# EAGLE design midimixer-st-eval (EAGLE 7.2.0)
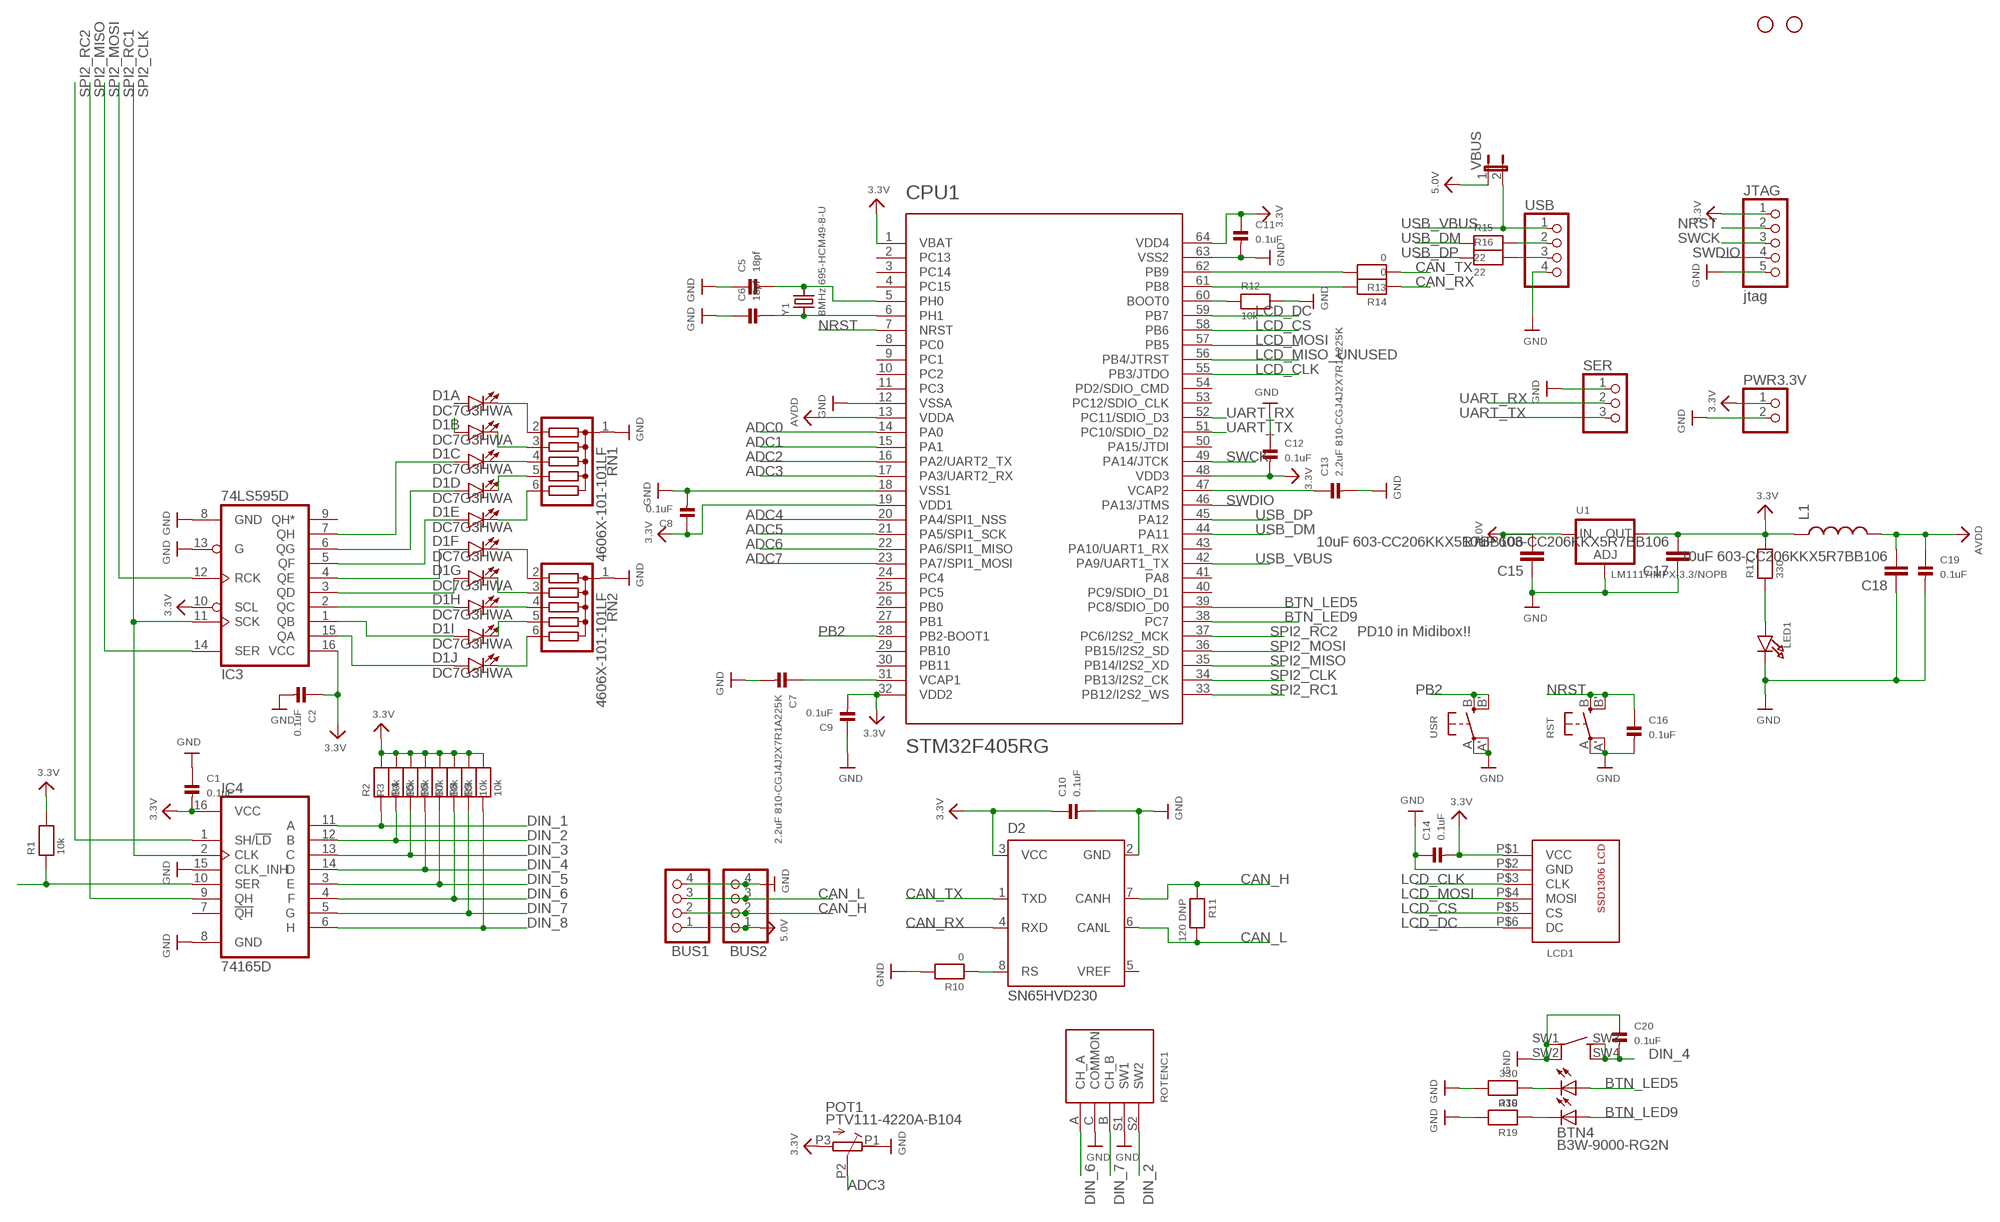
[diagram p0: schematic, sheet 1]

## Parts
BTN4  B3W-9000-RG2N  [B3W-9000-X2X]
BUS1  HEADER-1X4ROUND  [1X04_ROUND]
BUS2  HEADER-1X4ROUND  [1X04_ROUND]
C1  0.1uF  CAP_CERAMIC0603  [0603]
C2  0.1uF  CAP_CERAMIC0603  [0603]
C5  18pf  CAP_CERAMIC0603  [0603]
C6  18pf  CAP_CERAMIC0603  [0603]
C7  2.2uF 810-CGJ4J2X7R1A225K  CAP_CERAMIC0805  [0805]
C8  0.1uF  CAP_CERAMIC0603  [0603]
C9  0.1uF  CAP_CERAMIC0603  [0603]
C10  0.1uF  CAP_CERAMIC0603  [0603]
C11  0.1uF  CAP_CERAMIC0603  [0603]
C12  0.1uF  CAP_CERAMIC0603  [0603]
C13  2.2uF 810-CGJ4J2X7R1A225K  CAP_CERAMIC0805  [0805]
C14  0.1uF  CAP_CERAMIC0603  [0603]
C15  10uF 603-CC206KKX5R7BB106  CAP1206  [1206]
C16  0.1uF  CAP_CERAMIC0603  [0603]
C17  10uF 603-CC206KKX5R7BB106  CAP1206  [1206]
C18  10uF 603-CC206KKX5R7BB106  CAP1206  [1206]
C19  0.1uF  CAP_CERAMIC0603  [0603]
C20  0.1uF  CAP_CERAMIC0603  [0603]
CPU1  STM32F405RG  [TQFP64]
D1  DC7G3HWA  LED_BARGRAPH_10  [LED_BARGAPH_10]
D2  SN65HVD230  [SO8]
H1  STAND-OFF  [STAND-OFF]
H3  STAND-OFF  [STAND-OFF]
IC3  74LS595D  [SO16]
IC4  74165D  [SO16]
JTAG  jtag  HEADER-1X576MIL  [1X05_ROUND_76]
L1  INDUCTOR0805  [0805]
LCD1  SSD1306-ALI  [SSD1306-ALI]
LED1  LED0603  [CHIPLED_0603]
POT1  PTV111-4220A-B104  [PTV111-4]
PWR3.3V  HEADER-1X2ROUND  [1X02_ROUND]
R1  10k  RESISTOR_0603  [_0603]
R2  10k  RESISTOR_0603  [_0603]
R3  10k  RESISTOR_0603  [_0603]
R4  10k  RESISTOR_0603  [_0603]
R5  10k  RESISTOR_0603  [_0603]
R6  10k  RESISTOR_0603  [_0603]
R7  10k  RESISTOR_0603  [_0603]
R8  10k  RESISTOR_0603  [_0603]
R9  10k  RESISTOR_0603  [_0603]
R10  0  RESISTOR_0603  [_0603]
R11  120 DNP  RESISTOR_0603  [_0603]
R12  10k  RESISTOR_0603  [_0603]
R13  0  RESISTOR_0603  [_0603]
R14  0  RESISTOR_0603  [_0603]
R15  22  RESISTOR0603  [0603]
R16  22  RESISTOR0603  [0603]
R17  330  RESISTOR0603  [0603]
R18  330  RESISTOR0603  [0603]
R19  330  RESISTOR0603  [0603]
RN1  4606X-101-101LF  G05R  [SIL6]
RN2  4606X-101-101LF  G05R  [SIL6]
ROTENC1  PEC11-4215K-S0024  [PEC111-4XXXK-SXXXX]
RST  SWITCH_TACT_SMT  [EVQ-Q2]
SER  HEADER-1X3ROUND  [1X03_ROUND]
U1  LM1117IMPX-3.3/NOPB  LM1117SOT223-REFLOW  [SOT223-R]
USB  HEADER-1X4ROUND  [1X04_ROUND]
USR  SWITCH_TACT_SMT  [EVQ-Q2]
VBUS  JUMPER2  [JUMPER2]
Y1  8MHz 695-HCM49-8-U  CRYSTALSMD  [HC49UP]

## Nets
3.3V: C1.2 C2.1 C8.1 C9.2 C10.1 C11.1 C12.2 C14.2 C17.2 CPU1.1(VBAT) CPU1.19(VDD1) CPU1.32(VDD2) CPU1.48(VDD3) CPU1.64(VDD4) D2.3(VCC) IC3.10(SCL) IC3.16(VCC) IC4.16(VCC) JTAG.1 L1.1 LCD1.P$1(VCC) POT1.P3(E) PWR3.3V.1 R1.2 R2.2 R3.2 R4.2 R5.2 R6.2 R7.2 R8.2 R9.2 R17.2 U1.2(OUT)
5.0V: BUS1.1 BUS2.1 C15.2 U1.3(IN) VBUS.1
ADC0: CPU1.14(PA0)
ADC1: CPU1.15(PA1)
ADC2: CPU1.16(PA2/UART2_TX)
ADC3: CPU1.17(PA3/UART2_RX) POT1.P2(S)
ADC4: CPU1.20(PA4/SPI1_NSS)
ADC5: CPU1.21(PA5/SPI1_SCK)
ADC6: CPU1.22(PA6/SPI1_MISO)
ADC7: CPU1.23(PA7/SPI1_MOSI)
AVDD: C18.2 C19.1 CPU1.13(VDDA) L1.2
BTN_LED5: BTN4.LED1+ CPU1.39(PC8/SDIO_D0)
BTN_LED9: BTN4.LED2+ CPU1.38(PC7)
CAN_H: BUS1.2 BUS2.2 D2.7(CANH) R11.1
CAN_L: BUS1.3 BUS2.3 D2.6(CANL) R11.2
CAN_RX: D2.4(RXD) R14.1
CAN_TX: D2.1(TXD) R13.1
DIN_1: IC4.11(A) R2.1
DIN_2: IC4.12(B) R3.1 ROTENC1.S2(SW2)
DIN_3: IC4.13(C) R4.1
DIN_4: BTN4.SW3(SW2_A) BTN4.SW4(SW2_B) C20.2 IC4.14(D) R5.1
DIN_5: IC4.3(E) R6.1
DIN_6: IC4.4(F) R7.1 ROTENC1.A(CH_A)
DIN_7: IC4.5(G) R8.1 ROTENC1.B(CH_B)
DIN_8: IC4.6(H) R9.1
GND: BTN4.SW1(SW1_A) BTN4.SW2(SW1_B) BUS1.4 BUS2.4 C1.1 C2.2 C5.1 C6.1 C7.2 C8.2 C9.1 C10.2 C11.2 C12.1 C13.2 C14.1 C15.1 C16.2 C17.1 C18.1 C19.2 C20.1 CPU1.12(VSSA) CPU1.18(VSS1) CPU1.63(VSS2) D2.2(GND) IC3.8(GND) IC3.13(G) IC4.8(GND) IC4.15(CLK_INH) JTAG.5 LCD1.P$2(GND) LED1.C POT1.P1(A) PWR3.3V.2 R10.2 R12.2 R18.2 R19.2 RN1.1 RN2.1 ROTENC1.C(COMMON) ROTENC1.S1(SW1) RST.A'(P1) RST.A(P) SER.1 U1.1(ADJ) USB.4 USR.A'(P1) USR.A(P)
LCD_CLK: CPU1.55(PB3/JTDO) LCD1.P$3(CLK)
LCD_CS: CPU1.58(PB6) LCD1.P$5(CS)
LCD_DC: CPU1.59(PB7) LCD1.P$6(DC)
LCD_MISO_UNUSED: CPU1.56(PB4/JTRST)
LCD_MOSI: CPU1.57(PB5) LCD1.P$4(MOSI)
N$1: C6.2 CPU1.6(PH1) Y1.1
N$2: C5.2 CPU1.5(PH0) Y1.2
N$3: C13.1 CPU1.47(VCAP2)
N$4: C7.1 CPU1.31(VCAP1)
N$5: LED1.A R17.1
N$6: CPU1.60(BOOT0) R12.1
N$7: R15.2 USB.2
N$8: R16.2 USB.3
N$9: BTN4.LED1- R18.1
N$10: BTN4.LED2- R19.1
N$11: D1.2(B:A)
N$13: CPU1.62(PB9) R13.2
N$14: D1.20(A:C) RN1.2
N$15: D1.19(B:C) RN1.3
N$16: D1.18(C:C) RN1.4
N$17: D1.17(D:C) RN1.5
N$18: D1.16(E:C) RN1.6
N$19: D1.15(F:C) RN2.2
N$20: D1.14(G:C) RN2.3
N$21: D1.13(H:C) RN2.4
N$22: D1.12(I:C) RN2.5
N$23: D1.11(J:C) RN2.6
N$27: CPU1.61(PB8) R14.2
N$28: IC4.10(SER) R1.1
N$49: D1.10(J:A) IC3.15(QA)
N$50: D1.9(I:A) IC3.1(QB)
N$51: D1.8(H:A) IC3.2(QC)
N$52: D1.7(G:A) IC3.3(QD)
N$53: D1.6(F:A) IC3.4(QE)
N$54: D1.5(E:A) IC3.5(QF)
N$55: D1.4(D:A) IC3.6(QG)
N$56: D1.3(C:A) IC3.7(QH)
N$73: D2.8(RS) R10.1
NRST: C16.1 CPU1.7(NRST) JTAG.2 RST.B'(S1) RST.B(S)
PB2: CPU1.28(PB2-BOOT1) USR.B'(S1) USR.B(S)
SPI2_CLK: CPU1.34(PB13/I2S2_CK) IC3.11(SCK) IC4.2(CLK)
SPI2_MISO: CPU1.35(PB14/I2S2_XD) IC4.9(QH)
SPI2_MOSI: CPU1.36(PB15/I2S2_SD) IC3.14(SER)
SPI2_RC1: CPU1.33(PB12/I2S2_WS) IC3.12(RCK)
SPI2_RC2: CPU1.37(PC6/I2S2_MCK) IC4.1(SH/!LD)
SWCK: CPU1.49(PA14/JTCK) JTAG.3
SWDIO: CPU1.46(PA13/JTMS) JTAG.4
UART_RX: CPU1.52(PC11/SDIO_D3) SER.2
UART_TX: CPU1.51(PC10/SDIO_D2) SER.3
USB_DM: CPU1.44(PA11) R15.1
USB_DP: CPU1.45(PA12) R16.1
USB_VBUS: CPU1.42(PA9/UART1_TX) USB.1 VBUS.2
Unconnected: CPU1.2(PC13) CPU1.3(PC14) CPU1.4(PC15) CPU1.8(PC0) CPU1.9(PC1) CPU1.10(PC2) CPU1.11(PC3) CPU1.24(PC4) CPU1.25(PC5) CPU1.26(PB0) CPU1.27(PB1) CPU1.29(PB10) CPU1.30(PB11) CPU1.40(PC9/SDIO_D1) CPU1.41(PA8) CPU1.43(PA10/UART1_RX) CPU1.50(PA15/JTDI) CPU1.53(PC12/SDIO_CLK) CPU1.54(PD2/SDIO_CMD) D1.1(A:A) D2.5(VREF) IC3.9(QH*) IC4.7(!QH)

## Notes on the sheet
- PD10 in Midibox!!

## Library data of the parts
BTN4 = keves:B3W-9000-RG2N
BUS1 BUS2 USB = microbuilder:HEADER-1X4: PIN HEADER
C1 C2 C5-C14 C16 C19 C20 = microbuilder:CAP_CERAMIC: Ceramic Capacitors 0402 - 0402 Surface Mount Capacitors 16pF 50V 5% [Digikey: 445-4899-2-ND] 18pF 50V 5% [Digikey: 490-1281-2-ND] 22pF 50V 5% [Digikey: 490-1283-2-ND] 68pF 50V 5% [Digikey: 490-1289-2-ND] 0.1uF 10V 10% [Digikey: 490-1318-2-ND] 1.0uF 6.3V 10% [Digikey: 490-1320-2-ND] 0603 - 0603 Surface Mount Capacitors 16 pF 50V 5% [Digikey: 445-5051-2-ND] 22 pF 50V [Digikey: PCC220ACVTR-ND] 33 pF 50V 5% [Digikey: 490-1415-1-ND] 56pF 50V 5% [Digikey: 490-1421-1-ND] 220pF 50V 5% [Digikey: 445-1285-1-ND] 680 pF 50V 2200 pF 50V 5% C0G [Digikey: 445-1297-1-ND] 5600 pF 100V 5% X7R [Digikey: 478-3711-1-ND] 0.1 µF 25V 10% [Digikey: PCC2277TR-ND] 0.22 µF 16V 10% X7R [Digikey: 445-1318-1-ND] 1.0 µF 25V 10% [Digikey: 445-5146-2-ND] 0603 - RF Specific 3pF 250V +/-0.1pF RF [Digikey: 712-1347-1-ND] 18 pF 250V 5% [Digikey: 478-3505-1-ND or 712-1322-1-ND] 56 pF 250V 5% C0G RF [Digikey: 490-4867-1-ND] 68 pF 250V RF [Digikey: 490-4868-1-ND] 0805 - 0805 Surface Mount Capacitors 220 pF 250V 2% RF Ceramic Capacitor [Digikey: 712-1398-1-ND] 1000 pF 50V 2% NP0 Ceramic Capacitor [Digikey: 478-3760-1-ND] 0.1 µF 25V 10% Ceramic Capacitor [Digikey: PCC1828TR-ND] 1.0 µF 16V 10% Ceramic Capacitor[Digikey: 490-1691-2-ND] 10.0 µF 10V 10% Ceramic Capacitor[Digikey: 709-1228-1-ND] 10.0 uF 16V 10% Ceramic Capacitor [Digikey: 478-5165-2-ND] 47 uF 6.3V 20% Ceramic Capacitor [Digikey: 587-1779-1-ND or 399-5506-1-ND] 1206 - 1206 Surface Mount Capacitors 47uF 10V 20% Ceramic Capacitor [Digikey: 490-5528-1-ND or 399-5508-1-ND or 445-6010-1-ND] 100uF 6.3V -20%, +80% Y5V Ceramic Capacitor (Digikey: 490-4512-1-ND, Mouser: 81-GRM31CF50J107ZE1L)
C15 C17 C18 = SparkFun-Passives:CAP: Capacitor Standard 0603 ceramic capacitor, and 0.1" leaded capacitor.
CPU1 = SparkFun-DigitalIC:STM32F405RG: ARM DSP Chip used on the WAV Trigger board.
D1 = SparkFun-LED:LED_BARGRAPH_10: 10-Segment LED Bar Graph SFE part numbers: COM-09935 (red, Vf = 2.1V, Ifmax = 20mA) COM-09936 (yellow, Vf = 2.1V, Ifmax = 20mA) COM-09937 (blue, Vf = 3.4V, Ifmax = 20mA) COM-09938 (green, Vf = 3.4V, Ifmax = 20mA)
D2 = omc:SN65HVD230: SN65HVD230 - 3.3V CAN Transceiver - 3.3V operation - ISO 11898 compliant - up to 1Mbps - up to 120 nodes - listen only mode - slope control
H1 H3 = SparkFun-Electromechanical:STAND-OFF: #4 Stand Off This is the mechanical footprint for a #4 phillips button head screw. Use the keepout ring to avoid running the screw head into surrounding components. SKU : PRT-00447
IC3 = SparkFun-DigitalIC:74*595: 8-bit SHIFT REGISTER, output latch; PROD_ID: IC-07875
IC4 = SparkFun-DigitalIC:74*165
JTAG = microbuilder:HEADER-1X5: PIN HEADER
L1 = SparkFun-Passives:INDUCTOR: Inductors Basic Inductor/Choke - 0603 and 1206. Footprints are not proven and vary greatly between part numbers. INDUCTOR POWER 3.3UH 4.0A SMD 0.197" L x 0.197" W x 0.177" H (5.00mm x 5.00mm x 4.50mm)
LCD1 = keves:SSD1306-ALI
LED1 = microbuilder:LED: LED 0603 - 0603 Surface Mount Package 2mA: Green LED - Low Power (3.9mcd, 2ma, 1.7Vf) - Digikey: 475-2709-2-ND Orange LED - Low Power (9.8mcd, 2ma, 1.8Vf) - Digikey: 475-1194-2-ND Red LED - Low Power (5mcd, 2ma, 1.8Vf) - Digikey: 475-1195-2-ND Yellow LED - Low Power (7mcd, 2ma, 1.8Vf) - Digikey: 475-1196-2-ND 5mA: Blue LED - Low Power (17mcd, 5ma, 2.9Vf) - Digikey: LNJ937W8CRACT-ND 0805 - 0805 Surface Mount Package 2mA: Red LED (8.8mcd, 2mA, 1.8Vf, Clear) - Low Power [Digikey: 475-2510-1-ND] Green LED (5mcd, 2mA, 1.8Vf, Clear) - Low Power [Digikey: 475-2730-1-ND] Yellow LED (11.3mcd, 2mA, 1.8Vf, Clear) - Low Power [Digikey: 475-2555-1-ND] 20mA: Red LED (104mcd, 20mA, Diffused) - LS R976 [Digikey: 475-1278-6-ND] Red LED (12mcd, 20mA, 2.0Vf, Clear) - APT2012EC [Digikey: 754-1128-1-ND] Green LED (15mcd, 20mA, 2.2Vf, Clear) - APT2012GC [Digikey: 754-1131-1-ND] Orange LED (160mcd, 20mA, 2.1Vf, Clear) - APT2012SECK [Digikey: 754-1130-1-ND] 1206 - 1206 Surface Mount Package Green LED (26mcd, 20mA, Diffused) - LG N971 [Digikey: 475-1407-6-ND] Red LED (15mcd, 20mA, Diffused) - LH N974 [Digikey: 475-1416-6-ND]
POT1 = keves:PTV111-4220A-B104: ROT POT PTV111-4220A-B104 http://www.bourns.com/data/global/pdfs/PTVPTT.pdf
PWR3.3V = microbuilder:HEADER-1X2: PIN HEADER
R1-R19 = microbuilder:RESISTOR: Resistors 0402 - 0402 Surface Mount Package 22 Ohm 1% 1/16W [Digikey: 311-22.0LRTR-ND] 33 Ohm 5% 1/16W 1.0K 5% 1/16W 1.5K 5% 1/16W 2.0K 1% 1/16W 10.0K 1% 1/16W [Digikey: 311-10.0KLRTR-ND] 10.0K 5% 1/16W [Digikey: RMCF0402JT10K0TR-ND] 12.1K 1% 1/16W [Digikey: 311-22.0LRTR-ND] 100.0K 5% 1/16W 0603 - 0603 Surface Mount Package 0 Ohm 1/10 Watt 1% Resistor 15 Ohm 1/10 Watt 1% Resistor 33 Ohm 1/10 Watt 1% Resistor 49.9 Ohm 1/10 Watt 1% Resistor 100 Ohm 1/10 Watt 1% Resistor 150 Ohm 1/10 Watt 1% Resistor 240 Ohm 1/10 Watt 1% Resistor 390 Ohm 1/10 Watt 1% Resistor 560 Ohm 1/10 Watt 1% Resistor 680 Ohm 1/10 Watt 1% Resistor 750 Ohm 1/10 Watt 1% Resistor 1.0K Ohm 1/10 Watt 1% Resistor 1.5K Ohm 1/10 Watt 1% Resistor 2.0K Ohm 1/10 Watt 1% Resistor 2.2K Ohm 1/10 Watt 1% Resistor 3.3K Ohm 1/10 Watt 1% Resistor 4.7K Ohm 1/10 Watt 1% Resistor 10.0K Ohm 1/10 Watt 1% Resistor 12.0K Ohm 1/10 Watt 1% Resistor 12.1K Ohm 1/10 Watt 1% Resistor 20.0K Ohm 1/10 Watt 1% Resistor 33.0K Ohm 1/10 Watt 1% Resistor 100.0K Ohm 1/10 Watt 1% Resistor 0805 - 0805 Surface Mount Package 0 Ohm 1/8 Watt 1% Resistor 33 Ohm 1/8 Watt 1% Resistor 100 Ohm 1/8 Watt 1% Resistor 150 Ohm 1/8 Watt 1% Resistor 200 Ohm 1/8 Watt 1% Resistor 240 Ohm 1/8 Watt 1% Resistor 330 Ohm 1/8 Watt 1% Resistor 390 Ohm 1/8 Watt 1% Resistor 470 Ohm 1/8 Watt 1% Resistor 1.0K Ohm 1/8 Watt 1% Resistor 1.5K Ohm 1/8 Watt 1% Resistor 2.0K Ohm 1/8 Watt 1% Resistor 4.7K Ohm 1/8 Watt 1% Resistor 5.1K Ohm 1/8 Watt 1% Resistor 5.6K Ohm 1/8 Watt 1% Resistor 10.0K Ohm 1/8 Watt 1% Resistor 22.0K Ohm 1/8 Watt 1% Resistor 33.0K Ohm 1/8 Watt 1% Resistor 100K Ohm 1/8 Watt 1% Resistor 1206 - 1206 Surface Mount Package 2012 - 2010 Surface Mount Package 0.11 Ohm 1/2 Watt 1% Resistor - Digikey: RHM.11UCT-ND
RN1 RN2 = resistor-sil:G05R: SIL RESISTOR; OC_FARNELL: unknown; OC_NEWARK: unknown
ROTENC1 = keves:PEC11-4215K-S0024
RST USR = microbuilder:SWITCH_TACT_SMT: SMT Tact Switches 6x6mm - Digikey: P12940SCT-ND KMR2 (4.6x2.8mm) - Digikey: 401-1426-1-ND EVQ-PQHB55 - Light Touch, 160GF (4.5x4.5mm) - Digikey: P8090SCT-ND
SER = microbuilder:HEADER-1X3: PIN HEADER
U1 = microbuilder:LM1117: LM1117 Voltage Regulator LM1117 Adjustable Voltage regulator [Digikey: LM1117IMP-ADJDKR-ND] LM1117 3.3V Voltage regulator [AP1117E33GDIDKR-ND] LM1117 5.0V Voltage regulator [AP1117E50GDIDKR-ND] SOT223-REFLOW - SOT223 package for solder paste/reflow ovens SOT223-WAVE - SOT223 package for hand-soldering (larger pads) Note: For the fixed-voltage regulators, simply set the ADJ pin to GND.
VBUS = microbuilder:JUMPER2: JUMPER - 2 Pins
Y1 = microbuilder:CRYSTAL: Crystals HC49UP - Surface Mount Crystal 4.0MHz 18pF +/-30ppm Surface Mount Crystal [Digikey: 535-9857-1-ND] 12.0 MHz Surface Mount Crystal [Digikey: 535-9869-6-ND] 25.0 MHz Surface Mount Crystal [Digikey: 535-9078-1-ND] 2.5 x 2.0mm - MEMs SMT Crystal 16.0 MHz 10pF 20ppm 2.5 x 2.0mm Crystal [Digikey -40-85°C: 535-10923-1-ND] 3.2 x 2.5mm - MEMs SMT Crystal 12.0 MHz 8pF 15ppm 3.2 x 2.5mm Crystal [Digikey: -10-70°C: 644-1047-1-ND -40-125°C: 644-1128-1-ND] 16.0 MHz 8pF 15ppm 3.2 x 2.5mm Crystal [Digikey: -10-70°C: 644-1049-1-ND -40-125°C: 644-1129-2-ND] 16.0 MHz 10pF 10ppm 3.2 x 2.5mm Crystal [Digikey: 644-1100-1-ND] 27.12 MHz 18pF 30ppm 3.2 x 2.5mm Crystal [Digikey: 887-1424-1-ND] 27.12MHz 10pF 10ppm 3.2 x 2.5mm Crystal [Digikey: 887-1329-1-ND] 4.9 x 1.8mm - MEMs SMT Crystal 32.768 KHz 12.5pF 20ppm 4.9 x 1.8mm Crystal [Digikey: SE2415CT-ND] 8.0 x 3.8mm - Surface Mount Crystal 32.768kHz 12.5pF 20ppm -40°C-85°C [Digikey: 535-9166-2-ND] Cylinder 32.768KHz Cylinder Crystal (2x6mm body) [Ex. Digikey: 300-8341-2-ND]

## Board
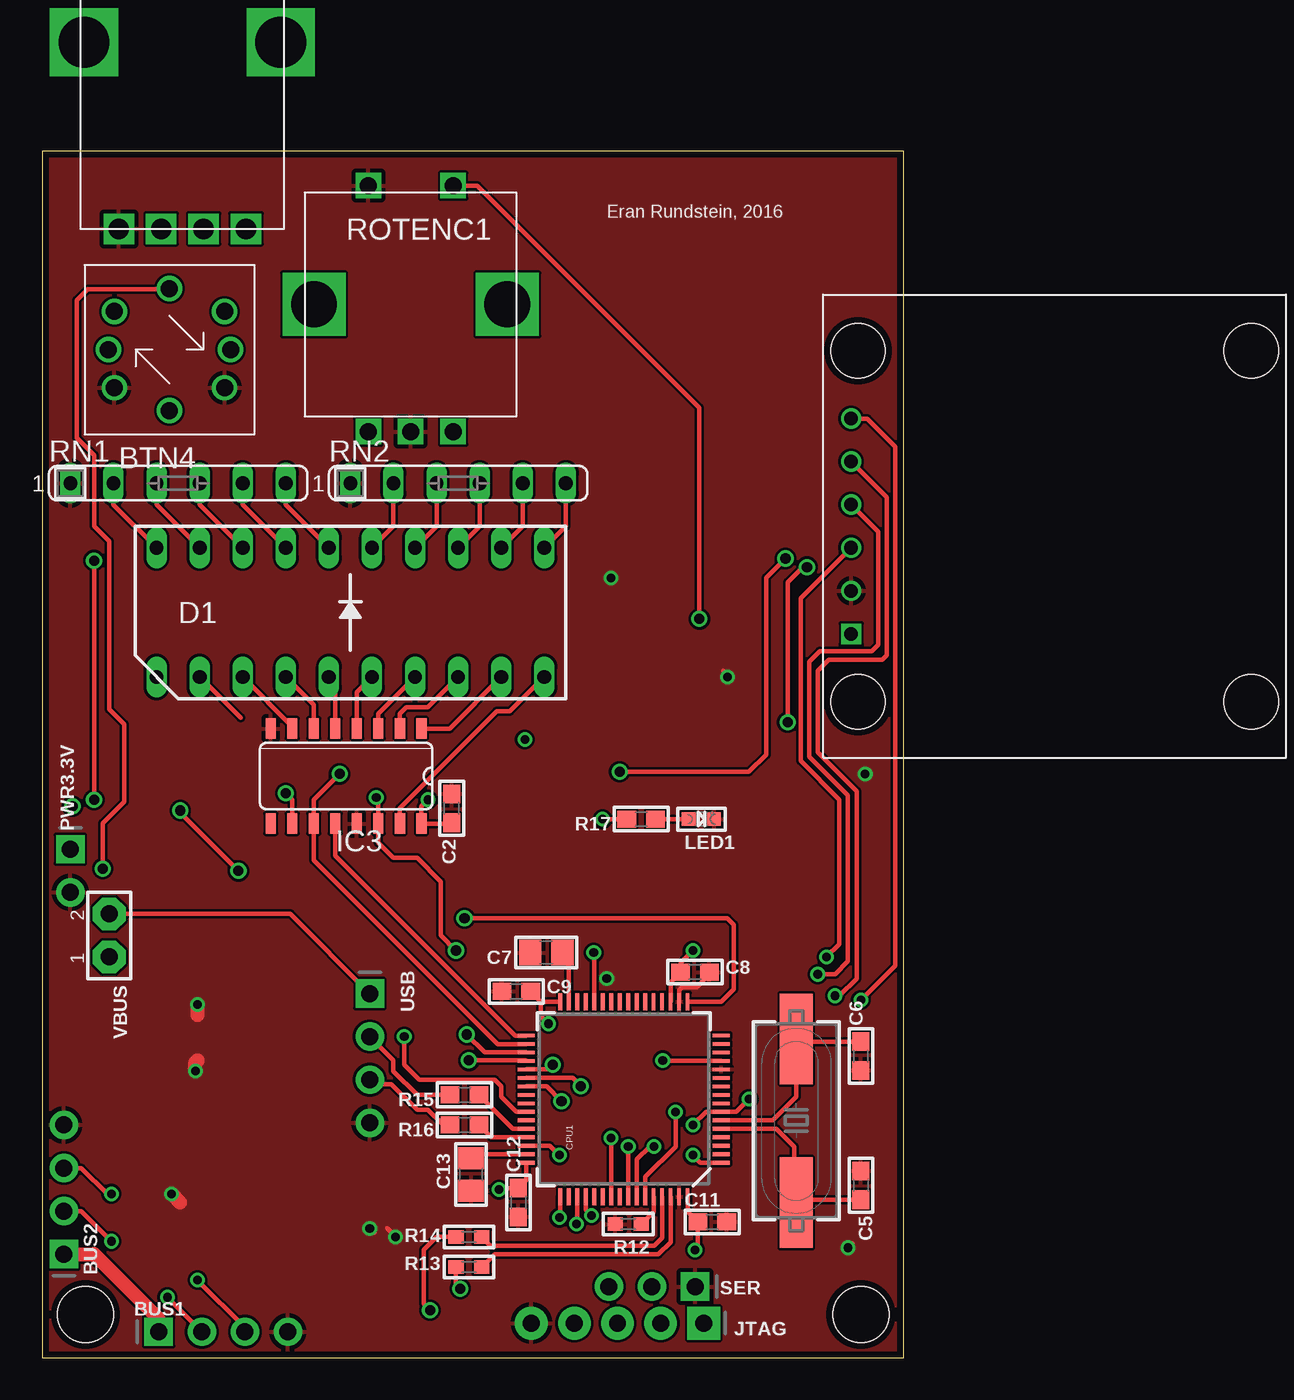
[diagram p1: board, top side]
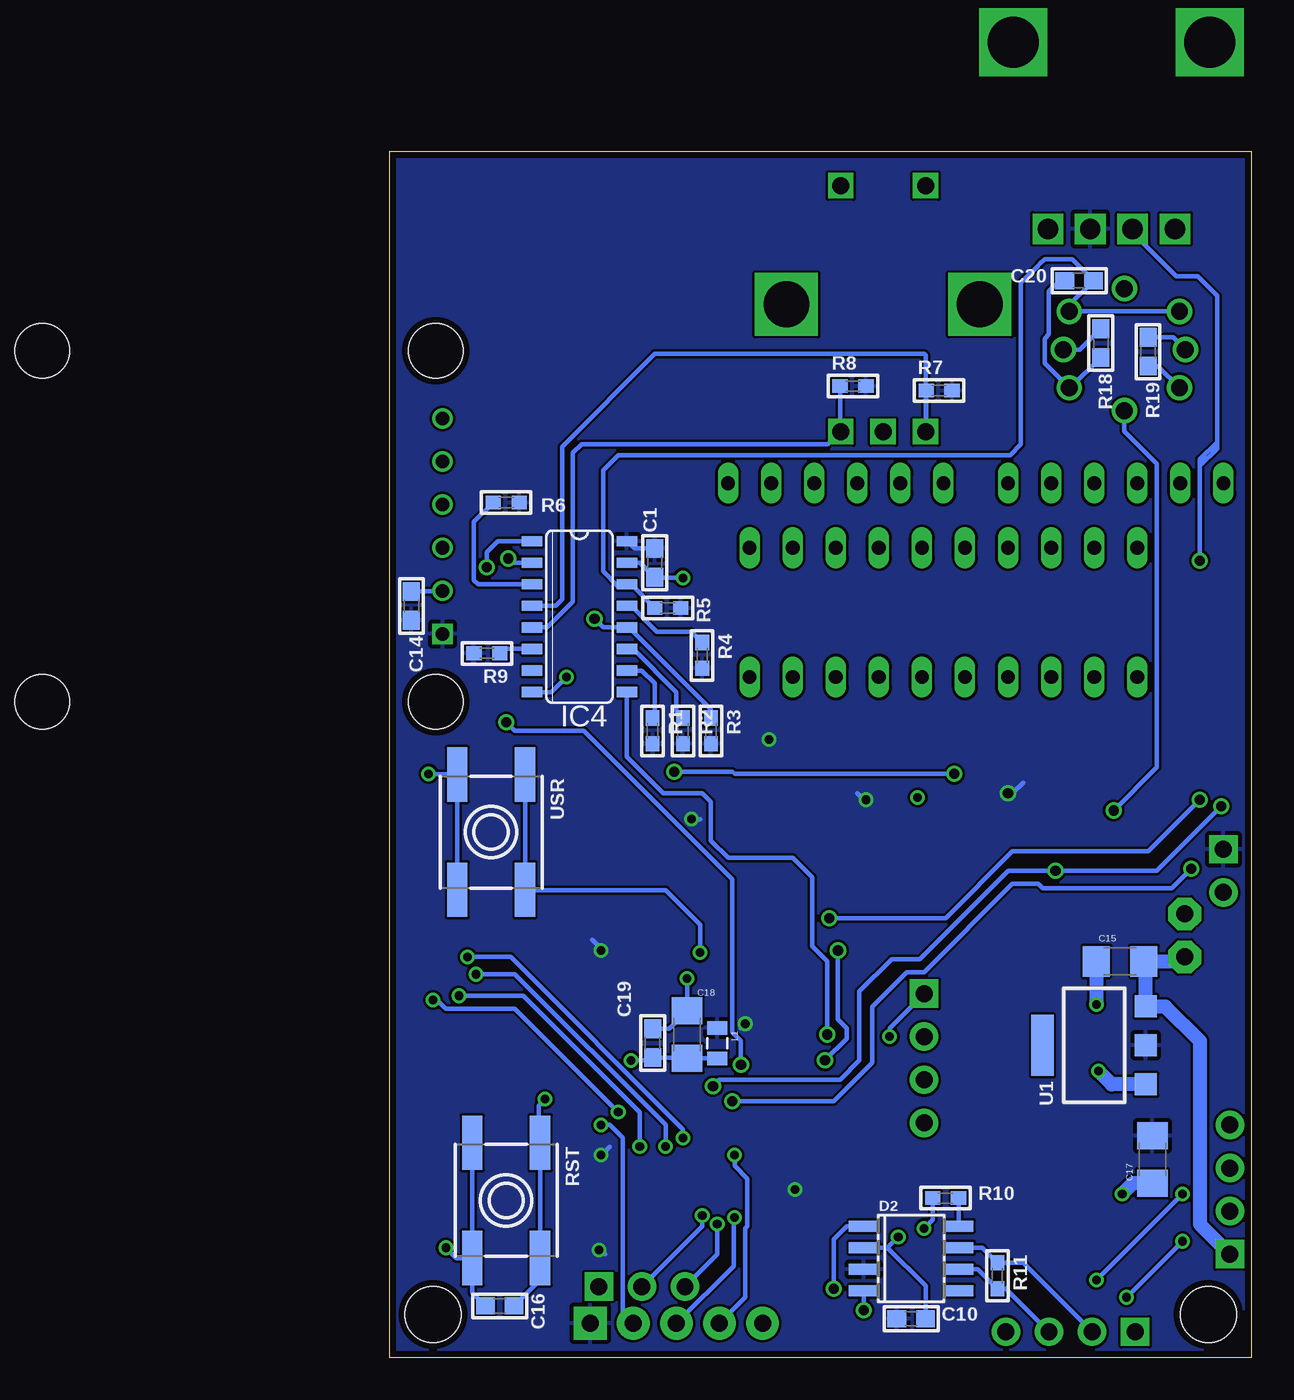
[diagram p2: board, bottom side, seen from below]

Size 50.8 x 71.12 mm. Coordinates in mm from the lower left corner, seen from the top.
Outline: 0,0 50.8,0 50.8,71.12 0,71.12 0,0
Copper layers (1*16): Top 0.0356mm / dielectric 1.5011mm / Bottom 0.0356mm
Design rules "oshpark *": minimum track width 6mil, minimum drill 13mil, track to track 6mil, track to pad 6mil, pad to pad 6mil, via to via 6mil, smd to smd 6mil, copper to edge 15mil, drill to drill 6mil, minimum pad ring 7mil, minimum via ring 7mil, stop-mask expansion 3mil, vias tented up to drill 0mil, thermal gap 10mil

### Footprints (pad centres in the part's own frame; a part is rotated, then mirrored left to right if it is on the bottom)
B3W-9000-X2X = drill 1: LED1+ 0,3.6; LED1- 3.6,0; LED2+ 0,-3.6; LED2- -3.6,0; SW1 3.25,-2.25; SW2 -3.25,-2.25; SW3 3.25,2.25; SW4 -3.25,2.25
1X04_ROUND = drill 1 pad 1.676 square: 1 -3.81,0 | drill 1 pad 1.676: 2 -1.27,0; 3 1.27,0; 4 3.81,0
0603 = smd 1.1 x 1: 1 -0.85,0; 2 0.85,0
0805 = smd 1.3 x 1.5: 1 -0.95,0; 2 0.95,0
1206 = smd 1.6 x 1.8: 1 -1.4,0; 2 1.4,0
TQFP64 = smd 0.22 x 1: 1 -3.75,-5.75; 2 -3.25,-5.75; 3 -2.75,-5.75; 4 -2.25,-5.75; 5 -1.75,-5.75; 6 -1.25,-5.75; 7 -0.75,-5.75; 8 -0.25,-5.75; 9 0.25,-5.75; 10 0.75,-5.75; 11 1.25,-5.75; 12 1.75,-5.75; 13 2.25,-5.75; 14 2.75,-5.75; 15 3.25,-5.75; 16 3.75,-5.75; 33 3.75,5.75; 34 3.25,5.75; 35 2.75,5.75; 36 2.25,5.75; 37 1.75,5.75; 38 1.25,5.75; 39 0.75,5.75; 40 0.25,5.75; 41 -0.25,5.75; 42 -0.75,5.75; 43 -1.25,5.75; 44 -1.75,5.75; 45 -2.25,5.75; 46 -2.75,5.75; 47 -3.25,5.75; 48 -3.75,5.75 | smd 1 x 0.22: 17 5.75,-3.75; 18 5.75,-3.25; 19 5.75,-2.75; 20 5.75,-2.25; 21 5.75,-1.75; 22 5.75,-1.25; 23 5.75,-0.75; 24 5.75,-0.25; 25 5.75,0.25; 26 5.75,0.75; 27 5.75,1.25; 28 5.75,1.75; 29 5.75,2.25; 30 5.75,2.75; 31 5.75,3.25; 32 5.75,3.75; 49 -5.75,3.75; 50 -5.75,3.25; 51 -5.75,2.75; 52 -5.75,2.25; 53 -5.75,1.75; 54 -5.75,1.25; 55 -5.75,0.75; 56 -5.75,0.25; 57 -5.75,-0.25; 58 -5.75,-0.75; 59 -5.75,-1.25; 60 -5.75,-1.75; 61 -5.75,-2.25; 62 -5.75,-2.75; 63 -5.75,-3.25; 64 -5.75,-3.75
LED_BARGAPH_10 = drill 0.813 long: 1 -11.43,-3.81; 2 -8.89,-3.81; 3 -6.35,-3.81; 4 -3.81,-3.81; 5 -1.27,-3.81; 6 1.27,-3.81; 7 3.81,-3.81; 8 6.35,-3.81; 9 8.89,-3.81; 10 11.43,-3.81; 11 11.43,3.81; 12 8.89,3.81; 13 6.35,3.81; 14 3.81,3.81; 15 1.27,3.81; 16 -1.27,3.81; 17 -3.81,3.81; 18 -6.35,3.81; 19 -8.89,3.81; 20 -11.43,3.81
SO8 = smd 0.65 x 1.75: 1 -1.905,-2.8; 2 -0.635,-2.8; 3 0.635,-2.8; 4 1.905,-2.8; 5 1.905,2.8; 6 0.635,2.8; 7 -0.635,2.8; 8 -1.905,2.8
STAND-OFF = hole 3.302: 0,0
SO16 = smd 0.6 x 1.2: 1 -4.445,-2.8; 2 -3.175,-2.8; 3 -1.905,-2.8; 4 -0.635,-2.8; 5 0.635,-2.8; 6 1.905,-2.8; 7 3.175,-2.8; 8 4.445,-2.8; 9 4.445,2.8; 10 3.175,2.8; 11 1.905,2.8; 12 0.635,2.8; 13 -0.635,2.8; 14 -1.905,2.8; 15 -3.175,2.8; 16 -4.445,2.8
1X05_ROUND_76 = drill 1 pad 1.93 square: 1 -5.08,0 | drill 1 pad 1.93: 2 -2.54,0; 3 0,0; 4 2.54,0; 5 5.08,0
0805' = smd 0.8 x 1.2: 1 -0.9,0; 2 0.9,0
SSD1306-ALI = drill 0.8 square: P$1 -6.35,12 | drill 0.8: P$2 -3.81,12; P$3 -1.27,12; P$4 1.27,12; P$5 3.81,12; P$6 6.35,12 | hole 3.2: -10.35,-11.6; -10.35,11.6; 10.35,11.6; 10.35,-11.6
CHIPLED_0603 = smd 0.8 x 0.8: A 0,-0.75; C 0,0.75
PTV111-4 = drill 1.2 square: P1 -3.75,0; P2 -1.25,0; P3 1.25,0; P4 3.75,0 | drill 3 square: P$1 -5.8,11; P$2 5.8,11
1X02_ROUND = drill 1 pad 1.676 square: 1 -1.27,0 | drill 1 pad 1.676: 2 1.27,0
_0603 = smd 0.9 x 0.8: 1 -0.762,0; 2 0.762,0
SIL6 = drill 0.813 long: 1 -6.35,0; 2 -3.81,0; 3 -1.27,0; 4 1.27,0; 5 3.81,0; 6 6.35,0
PEC111-4XXXK-SXXXX = drill 1 square: A -2.5,-7.5; B 2.5,-7.5; C 0,-7.5; S1 -2.5,7; S2 2.5,7 | drill 2.7 square: P$1 -5.7,0; P$2 5.7,0
EVQ-Q2 = smd 3.2 x 1.2: A -3.4,-2; A' 3.4,-2; B -3.4,2; B' 3.4,2
1X03_ROUND = drill 1 pad 1.676 square: 1 -2.54,0 | drill 1 pad 1.676: 2 0,0; 3 2.54,0
SOT223-R = smd 1.3 x 1.3: 1 -2.3,-3.05; 2 0,-3.05; 3 2.3,-3.05 | smd 3.6 x 1.3: 4 0,3.05
JUMPER2 = drill 1 pad 1.93 octagon: 1 2.54,0; 2 0,0
HC49UP = smd 5.334 x 1.93: 1 -4.826,0; 2 4.826,0

### Placement (x,y rotation side)
BTN4  7.49,59.44 0 top
BUS1  10.67,1.52 0 top
BUS2  1.27,9.91 90 top
C1  35.18,46.86 90 bottom
C2  24.13,32.38 90 top
C5  48.26,10.16 270 top
C6  48.26,17.78 90 top
C7  29.72,23.88 180 top
C8  38.48,22.73 0 top
C9  27.94,21.59 0 top
C10  20.07,2.29 0 bottom
C11  39.5,8 0 top
C12  28.07,9.14 90 top
C13  25.27,10.79 270 top
C14  49.53,44.32 270 bottom
C15  7.75,23.37 0 bottom
C16  44.32,3.05 180 bottom
C17  5.84,11.68 90 bottom
C18  33.27,19.05 270 bottom
C19  35.31,18.54 90 bottom
C20  10.16,63.5 0 bottom
CPU1  34.29,15.24 90 top
D1  18.16,43.94 0 top
D2  20.07,5.84 270 bottom
H1  48.26,2.54 0 top
H3  2.54,2.54 0 top
IC3  17.91,34.29 180 top
IC4  39.62,43.69 270 bottom
JTAG  33.91,2.03 180 top
L1  [0805']  31.5,18.54 270 bottom
LCD1  59.69,49.02 90 top
LED1  38.86,31.75 270 top
POT1  8.26,66.55 0 top
PWR3.3V  1.65,28.7 270 top
R1  35.31,36.96 270 bottom
R2  33.53,36.96 270 bottom
R3  31.88,36.96 270 bottom
R4  32.38,41.4 270 bottom
R5  34.42,44.2 0 bottom
R6  43.94,50.42 0 bottom
R7  18.41,57.02 0 bottom
R8  23.5,57.28 0 bottom
R9  45.09,41.53 180 bottom
R10  18.03,9.4 180 bottom
R11  14.99,4.83 270 bottom
R12  34.54,7.87 180 top
R13  25.15,5.33 0 top
R14  25.15,7.11 0 top
R15  24.89,15.49 180 top
R16  24.89,13.72 180 top
R17  35.31,31.75 180 top
R18  8.89,59.82 270 bottom
R19  6.1,59.31 270 bottom
RN1  8,51.56 0 top
RN2  24.51,51.56 0 top
ROTENC1  21.72,62.1 0 top
RST  43.94,9.27 270 bottom
SER  35.94,4.19 180 top
U1  9.27,18.41 90 bottom
USB  19.3,17.65 270 top
USR  44.83,30.99 270 bottom
VBUS  3.94,26.16 270 top
Y1  44.45,13.97 270 top

### Tracks (layer width: path | path; a pad name or v marks a point on that pad's centre or on a via)
3.3V  (via drill 0.51, 0.6)
  Top 0.254: C2.1 24.09,31.49 IC3.16 22.35,32.51 v22.73,32.89 | CPU1.19 37.04,22.14 C8.1 37.63,23.28 v38.35,24 | CPU1.32 29.39,20.99 | 29.39,20.99 C9.2 | 29.39,20.99 29.39,20.14 v29.84,19.68 | v26.92,9.91 27.01,9.99 C12.2 28.54,10.47 CPU1.48 | v38.48,6.35 38.65,6.52 C11.1 38.04,8.61 CPU1.64 | CPU1.1 38.8,11.49 v38.35,11.94 | R17.2 v33.02,31.75 | IC3.10 14.73,32.89 v14.35,33.27
  Bottom 0.254: v22.73,32.89 22.86,32.89 23.24,33.27 | C1.2 36.4,47.71 IC4.16 | v38.35,24 38.35,24.13 38.86,24.64 | v29.84,19.68 30.1,19.43 | v26.92,9.91 26.8,9.91 26.67,9.78 | v38.48,6.35 38.35,6.35 38.1,6.1 | v38.35,11.94 37.85,12.45 | v33.02,31.75 32.51,31.75 | v14.35,33.27 14.1,33.27 13.46,33.91
  other vias: 28.45,36.45
  pour Bottom: 0.13,70.99 0.13,0.13 50.67,0.13 50.67,70.99
5.0V
  Top 0.813: BUS2.1 3.05,6.1 6.86,2.29 BUS1.1
  Bottom 0.813: BUS2.1 3.05,7.87 3.05,18.67 5.08,20.7 6.21,20.7 U1.3 6.22,23.24 C15.2 4.19,23.37 VBUS.1
ADC3  (via drill 0.6)
  Top 0.254: CPU1.17 40.04,20.99 40.77,21.72 40.77,25.53 40.39,25.91 v24.89,25.91 | v3.05,32.89 v3.05,46.99
  Bottom 0.254: POT1.P2 7,66.31 4.45,63.75 3.17,63.75 2.03,62.61 2.03,53.98 | 2.03,53.98 2.03,53.59 3.05,52.58 | v3.05,32.89 6.1,29.84 14.1,29.84 18.03,25.91 v24.89,25.91 | v3.05,46.99 3.05,52.96 2.03,53.98
AVDD  (via drill 0.51)
  Top 0.254: CPU1.13 36.61,17.49 v36.58,17.53
  Bottom 0.254: v36.58,17.53 35.47,17.53 C19.1 33.32,17.69 C18.2 L1.2
BTN_LED5  (via drill 0.6)
  Top 0.254: CPU1.39 29.73,15.99 v30.61,15.11 | v3.56,28.83 3.56,31.5 4.83,32.77 4.83,37.34 3.94,38.23 3.94,48.13 3.05,49.02 3.05,53.21 2.03,54.23 2.03,62.36 2.67,62.99 7.45,62.99 BTN4.LED1+
  Bottom 0.254: v30.61,15.11 24.64,15.11 22.35,17.4 22.35,20.7 20.32,22.73 19.3,22.73 14.1,27.94 12.57,27.94 12.32,27.69 4.7,27.69 v3.56,28.83
BTN_LED9  (via drill 0.6)
  Top 0.254: CPU1.38 31.26,16.49 v31.75,16 | v8.13,32.26 8.13,32.13 v11.56,28.7
  Bottom 0.254: v31.75,16 31.37,16.38 24.26,16.38 23.11,17.53 23.11,21.59 21.21,23.5 19.56,23.5 14.35,28.7 v11.56,28.7 5.59,28.7 v1.78,32.51 | BTN4.LED2+ 7.49,54.61 5.59,52.7 5.59,34.8 v8.13,32.26
CAN_H  (via drill 0.51)
  Top 0.254: BUS2.2 2.29,8.64 v4.06,6.86 | BUS1.2 v7.37,3.56
  Bottom 0.254: D2.7 15.88,6.48 R11.1 13.46,5.59 BUS1.2 | v7.37,3.56 v4.06,6.86
CAN_L  (via drill 0.51)
  Top 0.254: BUS2.3 2.29,11.18 3.81,9.65 v4.06,9.65 | BUS1.3 11.94,1.78 v9.14,4.57
  Bottom 0.254: D2.6 16.13,5.21 R11.2 14.48,4.06 BUS1.3 | v9.14,4.57 v4.06,9.65
CAN_RX  (via drill 0.6)
  Top 0.254: R14.1 23.24,7.11 22.48,6.35 22.48,3.17 v22.86,2.79
  Bottom 0.254: 22.99,4.06 D2.4 v22.86,2.79
CAN_TX  (via drill 0.6)
  Top 0.254: R13.1 24.38,4.32 v24.64,4.06
  Bottom 0.254: v24.64,4.06 24.64,6.99 23.88,7.75 D2.1
DIN_1
  Bottom 0.254: IC4.11 36.45,41.78 33.91,39.24 33.91,38.1 R2.1
DIN_2  (via drill 0.6)
  Top 0.254: v38.73,43.56 38.73,56.01 25.65,69.09 24.23,69.09 ROTENC1.S2
  Bottom 0.254: R3.1 31.88,38.23 36.7,43.05 IC4.12 38.23,43.05 v38.73,43.56
DIN_3
  Bottom 0.254: IC4.13 36.58,44.32 35.05,42.8 33.02,42.8 R4.1
DIN_4
  Bottom 0.254: R5.1 36.58,45.59 IC4.14 36.95,45.47 37.34,45.47 38.23,46.35 38.23,52.32 37.34,53.21 14.22,53.21 13.59,53.85 13.59,63.37 12.57,64.39 12.45,64.52 12.19,64.77 10.58,64.77 C20.2 10.74,62.07 BTN4.SW3 BTN4.SW4
DIN_5
  Bottom 0.254: IC4.3 45.59,45.59 45.85,45.85 45.85,49.28 R6.1
DIN_6
  Bottom 0.254: R7.1 19.18,54.64 ROTENC1.A 19.22,59.09 19.3,59.18 35.18,59.18 40.64,53.72 40.64,44.7 41.02,44.32 IC4.4
DIN_7
  Bottom 0.254: R8.1 24.26,54.64 ROTENC1.B 24.97,53.85 39.5,53.85 40.01,53.34 40.01,44.58 41.53,43.05 IC4.5
DIN_8
  Bottom 0.254: IC4.6 44.07,41.78 R9.1
GND  (via drill 0.51)
  Top 0.254: v40.39,40.13 40.39,40.26 40.13,40.51 | CPU1.18 37.54,21.66 37.72,21.84 38.57,21.84 39.33,22.61 C8.2 | v20.83,7.11 20.32,7.62 | v19.3,7.62 19.56,7.37 | v33.27,22.35 33.27,22.61 | v47.5,6.48 47.75,6.73 | v33.53,45.97 33.4,45.97
  Top 0.813: v7.62,9.65 8.13,9.14 | v9.14,20.83 9.14,20.19 | v9.02,16.89 9.02,17.4 9.14,17.53
  Bottom 0.254: R18.2 10.67,57.19 BTN4.SW1 12.19,58.63 12.19,60.07 11.94,60.33 11.94,62.87 11.3,63.5 C20.1 | R19.2 5.52,58.46 BTN4.SW2 | C1.1 36.03,46.86 IC4.15 36.07,46.86 35.18,45.97 v33.53,45.97 | IC4.8 41.27,39.24 v40.39,40.13 | D2.2 21.46,6.48 | 21.46,6.48 v20.83,7.11 | R10.2 18.8,8.13 v19.3,7.62 | C10.2 19.22,4.23 21.46,6.48 | C19.2 34.33,19.39 C18.1 v33.27,22.35 | USR.A' USR.A 48.48,34.39 v48.51,34.42 | RST.A RST.A' | RST.A' 46.89,5.87 v47.5,6.48 | RST.A' 45.94,3.82 C16.2 | C14.1 47.73,45.17 LCD1.P$2
  Bottom 0.813: C17.1 6.99,10.28 v7.62,9.65 | C15.1 v9.15,20.83 v9.14,20.83 | U1.1 8.24,16.11 v9.02,16.89
  pour Top: 0.13,70.99 0.13,0.13 50.67,0.13 50.67,70.99
LCD_CLK  (via drill 0.51)
  Top 0.254: v33.53,12.95 33.53,11.68 33.54,11.67 CPU1.55 | v46.23,23.62 46.99,24.38 46.99,32.89 44.7,35.18 44.7,44.77 LCD1.P$3
  Bottom 0.254: v46.23,23.62 43.69,23.62 33.53,13.46 v33.53,12.95
LCD_CS  (via drill 0.51)
  Top 0.254: v36.07,12.45 35.81,12.45 35.05,11.68 35.05,9.5 CPU1.58 | v46.74,21.34 46.99,21.34 48.01,22.35 48.01,33.4 45.72,35.69 45.72,40.51 46.35,41.15 49.53,41.15 49.78,41.4 49.78,50.74 LCD1.P$5
  Bottom 0.254: v46.74,21.34 42.93,21.34 36.07,14.48 v36.07,12.45
LCD_DC  (via drill 0.51)
  Top 0.254: 48.51,21.34 v48.26,21.08 50.29,23.11 50.29,53.72 48.64,55.37 LCD1.P$6 | v37.34,14.48 37.34,12.45 35.56,10.67 35.56,9.51 CPU1.59
  Bottom 0.254: v48.26,21.08 48.01,21.08 47.5,20.57 43.43,20.57 v37.34,14.48
LCD_MOSI  (via drill 0.51)
  Top 0.254: v34.54,12.45 CPU1.57 | v45.72,22.61 46.74,22.61 47.5,23.37 47.5,33.15 45.21,35.43 45.21,41.02 45.85,41.66 48.9,41.66 49.28,42.04 49.28,48.71 LCD1.P$4
  Bottom 0.254: v34.54,12.45 34.54,13.72 43.43,22.61 v45.72,22.61
N$1
  Top 0.254: CPU1.6 43.07,13.99 44.45,15.37 Y1.1 44.62,18.63 C6.2
N$2
  Top 0.254: CPU1.5 43.28,13.49 44.32,12.45 44.32,11.18 44.45,11.05 44.45,10.79 44.7,10.54 44.7,9.4 Y1.2 44.62,9.31 C5.2
N$3
  Top 0.254: CPU1.47 25.52,11.99 C13.1
N$4
  Top 0.254: CPU1.31 31.04,23.5 C7.1
N$5
  Top 0.254: R17.1 LED1.A
N$6
  Top 0.254: CPU1.60 36.04,8.61 R12.1
N$7
  Top 0.254: R15.2 22.1,15.49 20.7,16.89 20.7,17.53 USB.2
N$8
  Top 0.254: R16.2 23.62,13.72 22.73,14.61 22.1,14.61 20.57,16.13 19.56,16.13 USB.3
N$9
  Bottom 0.254: BTN4.LED1- 10.12,59.44 R18.1
N$10
  Bottom 0.254: R19.1 4.62,60.16 BTN4.LED2-
N$11
  Top 0.254: 11.68,37.72 D1.2
N$13
  Top 0.254: CPU1.62 37.04,6.81 36.32,6.1 26.67,6.1 R13.2
N$14
  Top 0.254: RN1.2 4.19,50.29 D1.20
N$15
  Top 0.254: RN1.3 6.73,50.29 D1.19
N$16
  Top 0.254: RN1.4 9.27,50.29 D1.18
N$17
  Top 0.254: RN1.5 11.81,50.29 D1.17
N$18
  Top 0.254: RN1.6 14.35,50.29 D1.16
N$19
  Top 0.254: RN2.2 20.7,49.02 D1.15
N$20
  Top 0.254: RN2.3 23.24,49.02 D1.14
N$21
  Top 0.254: RN2.4 25.78,49.02 D1.13
N$22
  Top 0.254: RN2.5 28.32,49.02 D1.12
N$23
  Top 0.254: RN2.6 30.86,49.02 D1.11
N$27
  Top 0.254: CPU1.61 36.54,7.08 36.07,6.6 26.42,6.6 R14.2
N$28
  Bottom 0.254: IC4.10 35.94,40.51 35.18,39.75 35.18,37.85 R1.1
N$49
  Top 0.254: IC3.15 21.08,32.38 26.8,38.1 27.56,38.1 D1.10
N$50
  Top 0.254: IC3.1 24.01,37.09 D1.9
N$51
  Top 0.254: IC3.2 21.08,37.97 21.46,38.35 22.73,38.35 D1.8
N$52
  Top 0.254: IC3.3 19.81,37.97 D1.7
N$53
  Top 0.254: IC3.4 18.54,39.24 D1.6
N$54
  Top 0.254: IC3.5 17.27,39.75 D1.5
N$55
  Top 0.254: IC3.6 16,38.48 D1.4
N$56
  Top 0.254: IC3.7 14.73,37.21 D1.3
N$73
  Bottom 0.254: R10.1 D2.8
NRST  (via drill 0.51)
  Top 0.254: v38.35,13.72 39.13,14.49 CPU1.7 40.91,14.49 v41.66,15.24
  Bottom 0.254: v38.35,13.72 37.85,13.72 37.08,12.95 37.08,2.67 JTAG.2 | v41.66,15.24 42.04,14.86 42.04,12.77 RST.B RST.B' 41.94,4.58 C16.1
PB2  (via drill 0.51)
  Top 0.254: CPU1.28 32.54,23.85 v32.51,23.88
  Bottom 0.254: USR.B USR.B' 42.8,27.56 34.54,27.56 32.51,25.53 v32.51,23.88
SPI2_CLK  (via drill 0.6)
  Top 0.254: CPU1.34 26.85,18.49 16,29.34 IC3.11 16,32.89 v17.53,34.42 | v34.04,34.54 41.66,34.54 42.67,35.56 42.67,45.97 v43.81,47.12
  Bottom 0.254: v17.53,34.42 30.48,34.42 30.61,34.54 v34.04,34.54 | IC4.2 43.56,46.86 v43.81,47.12
SPI2_MISO  (via drill 0.6)
  Top 0.254: CPU1.35 26.08,17.99 v25.02,19.05
  Bottom 0.254: IC4.9 36.82,35.43 34.67,33.27 32.38,33.27 31.88,32.77 31.88,30.48 30.86,29.46 27.05,29.46 25.91,28.32 25.91,24.26 25.02,23.37 v25.02,19.05
SPI2_MOSI  (via drill 0.51, 0.6)
  Top 0.254: v19.68,33.02 19.81,32.89 IC3.14 19.81,30.35 20.7,29.46 22.1,29.46 23.5,28.07 23.5,24.89 v24.38,24 | v25.15,17.53 28.5,17.53 CPU1.36
  Bottom 0.254: v25.15,17.53 23.88,18.8 23.88,19.43 24.38,19.94 v24.38,24
SPI2_RC1
  Top 0.254: CPU1.33 27.87,18.99 17.27,29.59 IC3.12
SPI2_RC2  (via drill 0.6)
  Top 0.254: CPU1.37 29.82,16.99 v30.1,17.27 | v43.94,37.47 43.94,45.72 44.83,46.61 v45.09,46.61
  Bottom 0.254: v30.1,17.27 30.1,18.67 30.61,19.18 30.61,28.19 39.37,36.96 43.43,36.96 v43.94,37.47 | IC4.1 44.45,48.13 45.09,47.5 v45.09,46.61
SWCK  (via drill 0.51)
  Top 0.254: CPU1.49 30.54,8.31 v30.48,8.26
  Bottom 0.254: JTAG.3 30.54,5.4 30.54,8.2 v30.48,8.26
SWDIO  (via drill 0.51)
  Top 0.254: CPU1.46 29.93,12.49 v30.48,11.94
  Bottom 0.254: JTAG.4 29.84,3.56 29.84,7.62 29.72,7.75 29.72,10.54 30.48,11.3 v30.48,11.94
UART_RX  (via drill 0.51)
  Top 0.254: CPU1.52 32.04,8.73 v32.38,8.38
  Bottom 0.254: v32.38,8.38 32.38,7.75 SER.2
UART_TX  (via drill 0.51)
  Top 0.254: CPU1.51 31.54,7.92 v31.5,7.87
  Bottom 0.254: SER.3 31.5,6.1 v31.5,7.87
USB_DM
  Top 0.254: CPU1.44 27.75,13.49 R15.1
USB_DP
  Top 0.254: CPU1.45 26.47,12.99 R16.1
USB_VBUS  (via drill 0.51)
  Top 0.254: CPU1.42 27.93,14.49 27.05,15.37 27.05,16 26.67,16.38 22.23,16.38 21.34,17.27 v21.34,18.92 | VBUS.2 14.61,26.16 USB.1
  Bottom 0.254: v21.34,18.92 21.34,19.43 USB.1

### Text on the board
tNames: Eran Rundstein, 2016